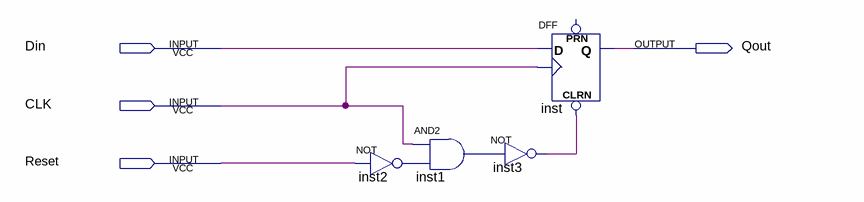
[diagram p0: schematic sheet]
// Quartus schematic d_flipflop_synchronous_reset.bdf as structural Verilog: 4 symbols, 4 pins
module d_flipflop_synchronous_reset (
  input  Din,
  input  CLK,
  input  Reset,
  output Qout
);

  wire inst1_out, inst2_out, inst3_out;

  not inst2 (inst2_out, Reset);
  and inst1 (inst1_out, CLK, inst2_out);
  DFF inst (.CLRN(inst3_out), .CLK(CLK), .D(Din), .Q(Qout));  // open: PRN
  not inst3 (inst3_out, inst1_out);
endmodule
